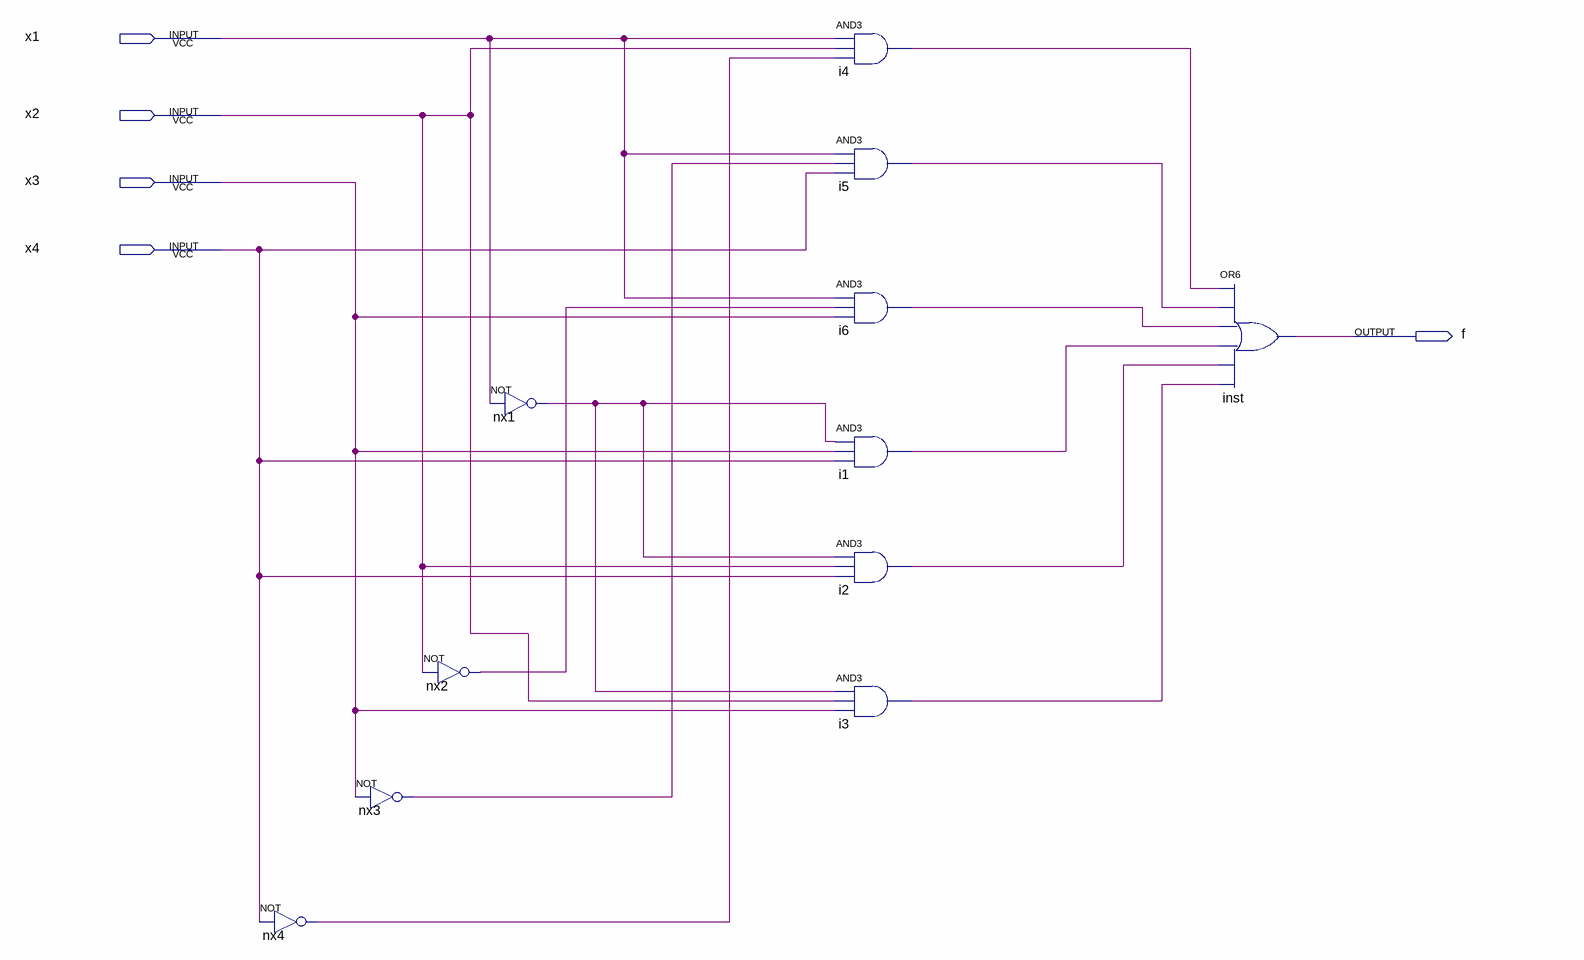
[diagram p0: schematic sheet]
// Quartus schematic problhma2.bdf as structural Verilog: 11 symbols, 5 pins
module problhma2 (
  input  x1,
  input  x2,
  input  x3,
  input  x4,
  output f
);

  wire i1_out, i2_out, i3_out, i4_out, i5_out, i6_out, nx1_out, nx2_out, nx3_out, nx4_out;

  not nx4 (nx4_out, x4);
  not nx3 (nx3_out, x3);
  not nx1 (nx1_out, x1);
  not nx2 (nx2_out, x2);
  and i4 (i4_out, x1, x2, nx4_out);
  and i5 (i5_out, x1, nx3_out, x4);
  and i6 (i6_out, x1, nx2_out, x3);
  and i1 (i1_out, nx1_out, x3, x4);
  and i2 (i2_out, nx1_out, x2, x4);
  and i3 (i3_out, nx1_out, x2, x3);
  or inst (f, i4_out, i5_out, i6_out, i1_out, i2_out, i3_out);
endmodule
